# Altium schematic sheet caculator schematic.SchDoc
size A3; SheetNumber: 1; SheetTotal: 1
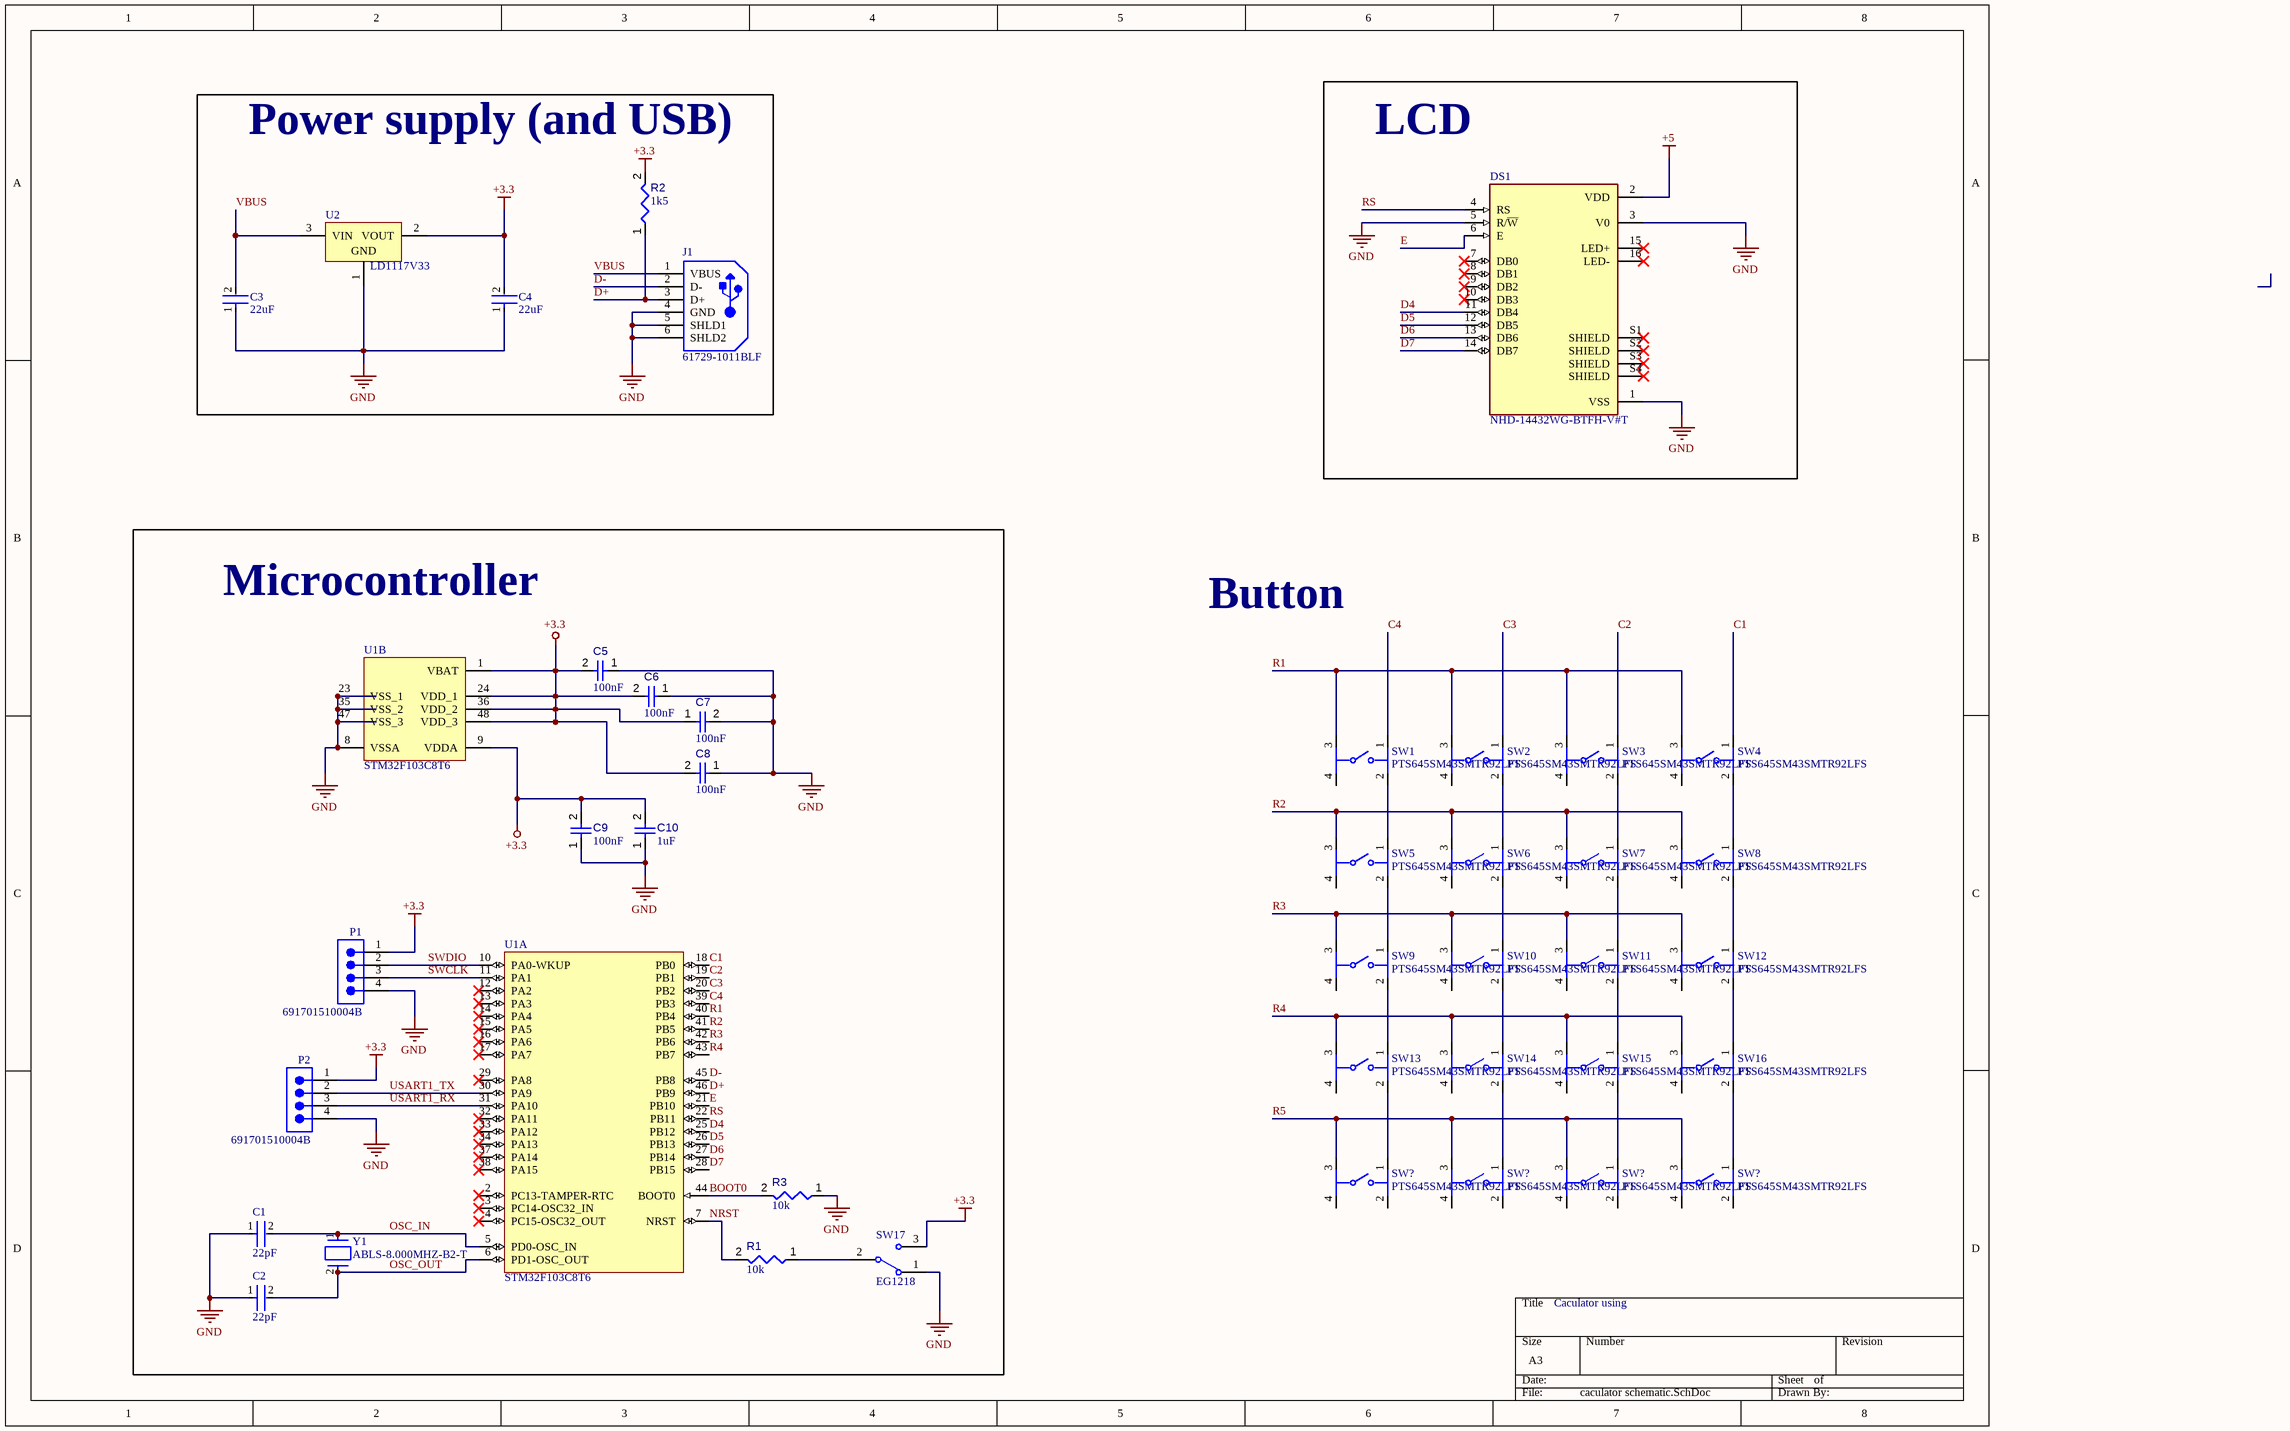
[diagram p0: caculator schematic.SchDoc]

## Parts
(Parts that share a designator on the sheet are numbered #1, #2 ... from top to bottom, then left to right.)
C1  22pF  [FP-RCE0K1-MFG]
C2  22pF  [FP-RCE0K1-MFG]
C3  22uF  [FP-RCE0K1-MFG]
C4  22uF  [FP-RCE0K1-MFG]
C5  value 100nF  [CAPC1005X56X25LL10T15]  (hidden comment: Capacitor 0.1 uF +/- 5% 16 V 0402)
C6  value 100nF  [CAPC1005X56X25LL10T15]  (hidden comment: Capacitor 0.1 uF +/- 5% 16 V 0402)
C7  value 100nF  [CAPC1005X56X25LL10T15]  (hidden comment: Capacitor 0.1 uF +/- 5% 16 V 0402)
C8  value 100nF  [CAPC1005X56X25LL10T15]  (hidden comment: Capacitor 0.1 uF +/- 5% 16 V 0402)
C9  value 100nF  [CAPC1005X56X25LL10T15]  (hidden comment: Capacitor 0.1 uF +/- 5% 16 V 0402)
C10  value 1uF  [CAPC1005X56X25LL10T15]  (hidden comment: Capacitor 0.1 uF +/- 5% 16 V 0402)
DS1  NHD-14432WG-BTFH-V#T  [LCD_NHD-14432WG-BTFH-V#T]
J1  61729-1011BLF  [FCI-61729-1011BLF_V]
P1  691701510004B  [691701510004B]
P2  691701510004B  [691701510004B]
R1  value 10k  [RESC0402(1005)_L]  (hidden comment: Resistor 1K +/-5 % 0402 63 mW)
R2  value 1k5  [RESC0402(1005)_L]  (hidden comment: Resistor 1K +/-5 % 0402 63 mW)
R3  value 10k  [RESC0402(1005)_L]  (hidden comment: Resistor 1K +/-5 % 0402 63 mW)
SW1  PTS645SM43SMTR92LFS  [FP-PTS645SM43SMTR92LFS-MFG]
SW2  PTS645SM43SMTR92LFS  [FP-PTS645SM43SMTR92LFS-MFG]
SW3  PTS645SM43SMTR92LFS  [FP-PTS645SM43SMTR92LFS-MFG]
SW4  PTS645SM43SMTR92LFS  [FP-PTS645SM43SMTR92LFS-MFG]
SW5  PTS645SM43SMTR92LFS  [FP-PTS645SM43SMTR92LFS-MFG]
SW6  PTS645SM43SMTR92LFS  [FP-PTS645SM43SMTR92LFS-MFG]
SW7  PTS645SM43SMTR92LFS  [FP-PTS645SM43SMTR92LFS-MFG]
SW8  PTS645SM43SMTR92LFS  [FP-PTS645SM43SMTR92LFS-MFG]
SW9  PTS645SM43SMTR92LFS  [FP-PTS645SM43SMTR92LFS-MFG]
SW10  PTS645SM43SMTR92LFS  [FP-PTS645SM43SMTR92LFS-MFG]
SW11  PTS645SM43SMTR92LFS  [FP-PTS645SM43SMTR92LFS-MFG]
SW12  PTS645SM43SMTR92LFS  [FP-PTS645SM43SMTR92LFS-MFG]
SW13  PTS645SM43SMTR92LFS  [FP-PTS645SM43SMTR92LFS-MFG]
SW14  PTS645SM43SMTR92LFS  [FP-PTS645SM43SMTR92LFS-MFG]
SW15  PTS645SM43SMTR92LFS  [FP-PTS645SM43SMTR92LFS-MFG]
SW16  PTS645SM43SMTR92LFS  [FP-PTS645SM43SMTR92LFS-MFG]
SW17  EG1218  [ESWI-EG1218_V]
SW?#1  PTS645SM43SMTR92LFS  [FP-PTS645SM43SMTR92LFS-MFG]
SW?#2  PTS645SM43SMTR92LFS  [FP-PTS645SM43SMTR92LFS-MFG]
SW?#3  PTS645SM43SMTR92LFS  [FP-PTS645SM43SMTR92LFS-MFG]
SW?#4  PTS645SM43SMTR92LFS  [FP-PTS645SM43SMTR92LFS-MFG]
U1  STM32F103C8T6  [STM-LQFP48_M]  (parts A,B of 2)
U2  LD1117V33  [STM-TO220-3]
Y1  ABLS-8.000MHZ-B2-T  [FP-ABLS-MFG]

## Blocks framed on the sheet
Power supply (and USB): C3 C4 J1 R2 U2
LCD: DS1
Microcontroller: C1 C2 C5-C10 P1 P2 R1 R3 SW17 U1 Y1

## Nets
+3.3: C4.2 C5.2 C6.2 C7.1 C8.2 C9.2 C10.2 P1.1 P2.1 R2.2 SW17.3 U1.1(VBAT) U1.9(VDDA) U1.24(VDD_1) U1.36(VDD_2) U1.48(VDD_3) U2.2(VOUT)
+5: DS1.2(VDD)
GND: C1.1 C2.1 C3.1 C4.1 C5.1 C6.1 C7.2 C8.1 C9.1 C10.1 DS1.1(VSS) DS1.3(V0) DS1.5(R/~{W}) J1.4(GND) J1.5(SHLD1) J1.6(SHLD2) P1.4 P2.4 R3.1 SW17.1 U1.8(VSSA) U1.23(VSS_1) U1.35(VSS_2) U1.47(VSS_3) U2.1(GND)
BOOT0: R3.2 U1.44(BOOT0)
C1: SW4.1 U1.18(PB0)
C2: SW3.1 U1.19(PB1)
C3: SW2.1 U1.20(PB2)
C4: SW1.1 U1.39(PB3)
D4: DS1.11(DB4) U1.25(PB12)
D5: DS1.12(DB5) U1.26(PB13)
D6: DS1.13(DB6) U1.27(PB14)
D7: DS1.14(DB7) U1.28(PB15)
D+: J1.3(D+) R2.1 U1.46(PB9)
D-: J1.2(D-) U1.45(PB8)
E: DS1.6(E) U1.21(PB10)
NRST: R1.2 U1.7(NRST)
OSC_IN: C1.2 U1.5(PD0-OSC_IN) Y1.1
OSC_OUT: C2.2 U1.6(PD1-OSC_OUT) Y1.2
R1: SW1.3 SW2.3 SW3.3 SW4.3 U1.40(PB4)
R2: SW5.3 SW6.3 SW7.3 SW8.3 U1.41(PB5)
R3: SW9.3 SW10.3 SW11.3 SW12.3 U1.42(PB6)
R4: SW13.3 SW14.3 SW15.3 SW16.3 U1.43(PB7)
R5: SW?#1.3 SW?#2.3 SW?#3.3 SW?#4.3
RS: DS1.4(RS) U1.22(PB11)
SWCLK: P1.3 U1.11(PA1)
SWDIO: P1.2 U1.10(PA0-WKUP)
USART1_RX: P2.3 U1.31(PA10)
USART1_TX: P2.2 U1.30(PA9)
VBUS: C3.2 J1.1(VBUS) U2.3(VIN)
NetR1_1: R1.1 SW17.2(COM)
NetSW1_2: SW1.2 SW5.1
NetSW2_2: SW2.2 SW6.1
NetSW3_2: SW3.2 SW7.1
NetSW4_2: SW4.2 SW8.1
NetSW5_2: SW5.2 SW9.1
NetSW6_2: SW6.2 SW10.1
NetSW7_2: SW7.2 SW11.1
NetSW8_2: SW8.2 SW12.1
NetSW9_2: SW9.2 SW13.1
NetSW10_2: SW10.2 SW14.1
NetSW11_2: SW11.2 SW15.1
NetSW12_2: SW12.2 SW16.1
NetSW13_2: SW13.2 SW?#1.1
NetSW14_2: SW14.2 SW?#2.1
NetSW15_2: SW15.2 SW?#3.1
NetSW16_2: SW16.2 SW?#4.1

Not connected (* = marked no-connect by the designer): DS1 7(DB0)* 8(DB1)* 9(DB2)* 10(DB3)* 15(LED+)* 16(LED-)* S1(SHIELD)* S2(SHIELD)* S3(SHIELD)* S4(SHIELD)*; SW1 4; SW2 4; SW3 4; SW4 4; SW5 4; SW6 4; SW7 4; SW8 4; SW9 4; SW10 4; SW11 4; SW12 4; SW13 4; SW14 4; SW15 4; SW16 4; SW?#1 2 4; SW?#2 2 4; SW?#3 2 4; SW?#4 2 4; U1 2(PC13-TAMPER-RTC)* 3(PC14-OSC32_IN)* 4(PC15-OSC32_OUT)* 12(PA2)* 13(PA3)* 14(PA4)* 15(PA5)* 16(PA6)* 17(PA7)* 29(PA8)* 32(PA11)* 33(PA12)* 34(PA13)* 37(PA14)* 38(PA15)*

## Notes on the sheet
- Button
- Caculator using

## Library data of the parts
C1-C4 = CMP-06035-047580-1: Cap Ceramic 22pF 50V C0G ±5% Radial 5mm +125°C Automotive Bulk; Lead/Base Style: Formed Leads; Lead Diameter: 0.5mm; Tolerance: 5%; Dielectric: C0G; Case/Package: Radial; Min Operating Temperature: -55°C; Height: 3.5mm; Length: 0.142inch; Height - Seated (Max): 0.138inch; Lead Pitch: 0.197inch; Resistor Type: Ceramic; Max Operating Temperature: 125°C; Package Quantity: 500; Capacitance: 22pF; Mount: Through Hole; Ratings: AEC-Q200; Termination: Radial; Voltage Rating: 50V; Width: 0.098inch; Voltage Rating (DC): 50V; Packaging: Bulk
C5-C10 = CMP-001-00001-6: Chip Capacitor, 0.1 uF, +/- 5%, 16 V, 0402 (1005 Metric); Capacitor Type: Ceramic; Voltage Rating: 16V; Max Operating Temperature: 125°C; Min Operating Temperature: -55°C; Case/Package: 0402; Mounting Technology: SM; Pins: 2; Tolerance: 5%; RoHS Compliant: True
DS1 = CMP-007-00039-1: - Graphic LCD Display Module Transflective Black (White - Inverted) FSTN - Film Super-Twisted Nematic Parallel, 8-Bit - 144 x 32; MF: Newhaven Display; Pins: 20; Value: *; Source: NHD-14432WG-BTFH-V#T.SchLib; SnapEDA_Link: https://www.snapeda.com/parts/NHD-14432WG-BTFH-V%23T/Newhaven+Display+Intl/view-part/?ref=snap; Purchase-URL: https://pricing.snapeda.com/search/part/NHD-14432WG-BTFH-V#T/?ref=eda; Case/Package: None; Check_prices: https://www.snapeda.com/parts/NHD-14432WG-BTFH-V%23T/Newhaven+Display+Intl/view-part/?ref=eda; Price: None; Design Item ID: NHD-14432WG-BTFH-V#T; MP: NHD-14432WG-BTFH-V#T; Availability: In Stock; Component Type: Standard
J1 = CMP-002-00041-2: USB Receptacle B Type, Right Angle, 4 Position, Height 11.5 mm,-40 to 85 degC, RoHS, Tube; Manufacturer: FCI Electronics; Current Rating: 1.5A; Gender: Female; Contact Material: Copper; Contact Plating: Nickel; Colour: Black; Max Operating Temperature: 40°C; Datasheet URL: http://portal.fciconnect.com/Comergent/fci/drawing/61729.pdf; Pins: 4; Lead Pitch: 2.5mm; Mounting Technology: TH; Packaging: Rail/Tube; Package Description: 4-Pin Through Hole Device, Body 16 x 12.2 mm; RoHS Compliant: True; Case/Package: 61729-1011BLF; Package Quantity: 44; Manufacturer URL: http://portal.fciconnect.com/; Package Reference: 61729-1011BLF; Datasheet Version: Rev. W, 05/2014; Connector Type: USB; Min Operating Temperature: 0°C
P1 P2 = CMP-1502-02331-3: Terminal Block, 5.08MM, Close Vertical Pcb Header, Thr Type, 4 Pins; Number of Contacts: 4; Voltage Rating: 300V; Current Rating: 10A; Gender: Male; Contact Material: Brass; Number of Pins: 4; REACH SVHC: Unknown; Lead Pitch: 5.08mm; Connector Type: Terminal Block; Max Operating Temperature: 105°C; Min Operating Temperature: -40°C; Housing Material: Polymer; Contact Plating: Tin; Mount: Through Hole; RoHS: Compliant; Color: Black; Pitch: 5.08mm; Length: 23.12mm; Termination: PCB
R1-R3 = CMP-009-00157-3: Chip Resistor, 1 kOhms, +/-5 %, 63 mW, -55 to 155 degC, 0402; Tolerance: 5%; Power: 63mW; Case/Package: 0402; Pins: 2; Min Operating Temperature: -55°C; Max Operating Temperature: 155°C
SW1-SW16 SW?#1-SW?#4 = CMP-2000-05160-2: SWITCH TACTILE SPST-NO 0.05A 12V; Contact Resistance: 100mR; Throw Configuration: SPST; Illumination Type: Non-Illuminated; Mechanical Life: 100000Cycles; Current Rating: 50mA; Switch Function: Off-Mom; Actuator Length: 0.85mm; Actuator Material: Nylon; Actuator Type: Standard; Operating Force: 160gf; Min Operating Temperature: -20°C; REACH SVHC: No SVHC; Termination: Gull Wing; Case/Package: SMD/SMT; Packaging: Tape and Reel; Mount: Surface Mount; Voltage Rating (DC): 12V; Orientation: Straight; Lead Free: Lead Free; Contact Material: Silver; Color: Black; Max Current Rating: 50mA; Contact Plating: Silver; Depth: 9mm; Package Quantity: 1; Max Voltage Rating (DC): 12V; Length: 6mm; Max Operating Temperature: 60°C
SW17 = CMP-011-00006-2: Slide Switch, SPDT, 500 V, -20 to 70 degC, 3-Pin THD, RoHS, Bulk; Manufacturer: E-Switch; Voltage Rating (DC): 30V; Current Rating: 200mA; Operating Force: 250gf; Package Quantity: 1000; Contact Plating: Silver; Max Operating Temperature: 70°C; Min Operating Temperature: -20°C; Contact Material: Copper; Datasheet URL: https://www.e-switch.com/system/asset/product_line/data_sheet/119/EG.pdf; Contact Finish: Silver; Case/Package: EG1218; Voltage Rating (AC): 30V; Datasheet Version: Oct-15; Package Description: 3-Pin Through Hole Device, Body 11.6 x 4 mm, Pitch 2.5 mm; RoHS Compliant: True; Package Reference: EG1218; Manufacturer URL: http://www.e-switch.ch/en/; Throw Configuration: SPDT; Contact Current Rating: 200mA; Mounting Technology: TH; Packaging: Bulk; Pins: 3
U1 = CMP-00001-1: MCU 32-bit STM32F1 ARM Cortex M3 RISC 64KB Flash 2.5V/3.3V 48-Pin LQFP Tray; Manufacturer Package Identifier: ai14911d; Number of I/Os: 37; Number of PWM Channels: 1; Nominal Supply Current: 1.7µA; Number of USART Channels: 3; Data Bus Width: 32b; Number of Programmable I/O: 48; Peripherals: POR; Clock Frequency: 16MHz; Number of Interrupts: 16; Number of I2C Channels: 2; ADC Channels (Resolution): 10-Ch 12-Bit; Max Power Dissipation: 363mW; Frequency: 72MHz; Number of Bits: 32; RAM Size: 20kB; EEPROM Memory Size: 0B; Max Supply Current: 50mA; Density: 512kb; Operating Supply Voltage: 3.3V; Interface: CAN, USB; Number of ADC Channels: 10; Number of Timers/Counters: 4; Oscillator Type: Internal; Watchdog Timer: Yes; Min Supply Voltage: 2V; Max Supply Voltage: 3.6V; RoHS: Compliant; Memory Size: 64kB; Harmonized Tariff Schedule (HTS) Code: 8542.31.00.25; Country of Origin: Malaysia; Length: 7mm; REACH SVHC: Yes; Introduction Date: 2007-06-07; Core Architecture: ARM; Radiation Hardening: No; Termination: SMD/SMT; Address Bus Width: 32b; Pins: 48; Lead Free: Lead Free; Schedule B: 8542310000; Width: 7mm; Number of SPI Channels: 2; Flash Memory Size: 64kB; Memory Format: FLASH; Height - Seated (Max): 1.6mm; Temperature Grade: Industrial; Case/Package: LQFP; Number of A/D Converters: 2; Height: 1.45mm; Export Control Classification Number (ECCN) Code: 3A991.A.2; Number of Terminals: 48; Lifecycle Status: Production; Number of Channels: 10; Min Operating Temperature: -40°C; Mounting Technology: Surface Mount; Terminal Pitch: 500µm; Max Operating Temperature: 85°C; China RoHS: Compliant
U2 = CMP-019-00020-3: Low Drop Positive Voltage Regulator, 800 mA, Fixed 3.3 V Output, 0 to 125 degC, 3-Pin TO-220, RoHS, Tube; Manufacturer: STMicroelectronics; Max Supply Voltage: 15V; Max Ouput Current: 800mA; Output Voltage: 3.3V; Power: 12W; Min Supply Voltage: 4.75V; Output Current: 1.3A; Outputs: 1; Min Input Voltage: 4.4V; Dropout Voltage: 1.1V; Datasheet Version: Rev. A, 07/2003; Case/Package: TO-220-3; Package Quantity: 50; Max Input Voltage: 15V; Manufacturer URL: http://www.st.com/; Min Operating Temperature: 0°C; Datasheet URL: http://www.farnell.com/datasheets/1776449.pdf; Max Operating Temperature: 125°C; Nominal Output Voltage: 3.3V; RoHS Compliant: True; Pins: 3; Packaging: Rail/Tube
Y1 = CMP-27762-009874-1: CRYSTAL 8.0000MHZ 18PF SMD; ESR (Equivalent Series Resistance): 80R; Operating Frequency: 8 MHz; Frequency Stability: 50ppm; Tolerance: 20ppm; Frequency: 8MHz; Min Operating Temperature: -20°C; Lead Free: Lead Free; Width: 4.7mm; Packaging: Tape and Reel; Series: ABLS; Accuracy: 20ppm; Length: 11.4mm; Frequency Tolerance: 20ppm; Termination: SMD/SMT; Number of Pins: 2; Radiation Hardening: No; Depth: 4.7mm; REACH SVHC: No SVHC; Contact Plating: Tin; Load Capacitance: 18pF; Case/Package: SMD/SMT; Mount: Surface Mount; Package Quantity: 1000; Max Operating Temperature: 70°C; Height: 0.165inch; Series Resistance: 80R